# Altium schematic sheet eSolderControl_v3.SchDoc: =GlobalProjectName
size 410 x 297 mm; Author: Смирнов; SheetNumber: 1; SheetTotal: 1; PageSetup: Record=PageOptions|CenterHorizontal=True|CenterVertical=True|PrintScale=1.00|XCorrection=1.00|YCorrection=1.00|PrintKind=1|BorderSize=5000000|LeftOffset=0|BottomOffset=0|Orientation=2|PaperLength=1000|PaperWidth=1000|Scale=100|PaperSource=15|PrintQuality=1200|MediaType=1|DitherType=10|PaperKind=A3|PrintScaleMode=1; Weight: -; ScaleFactor: -
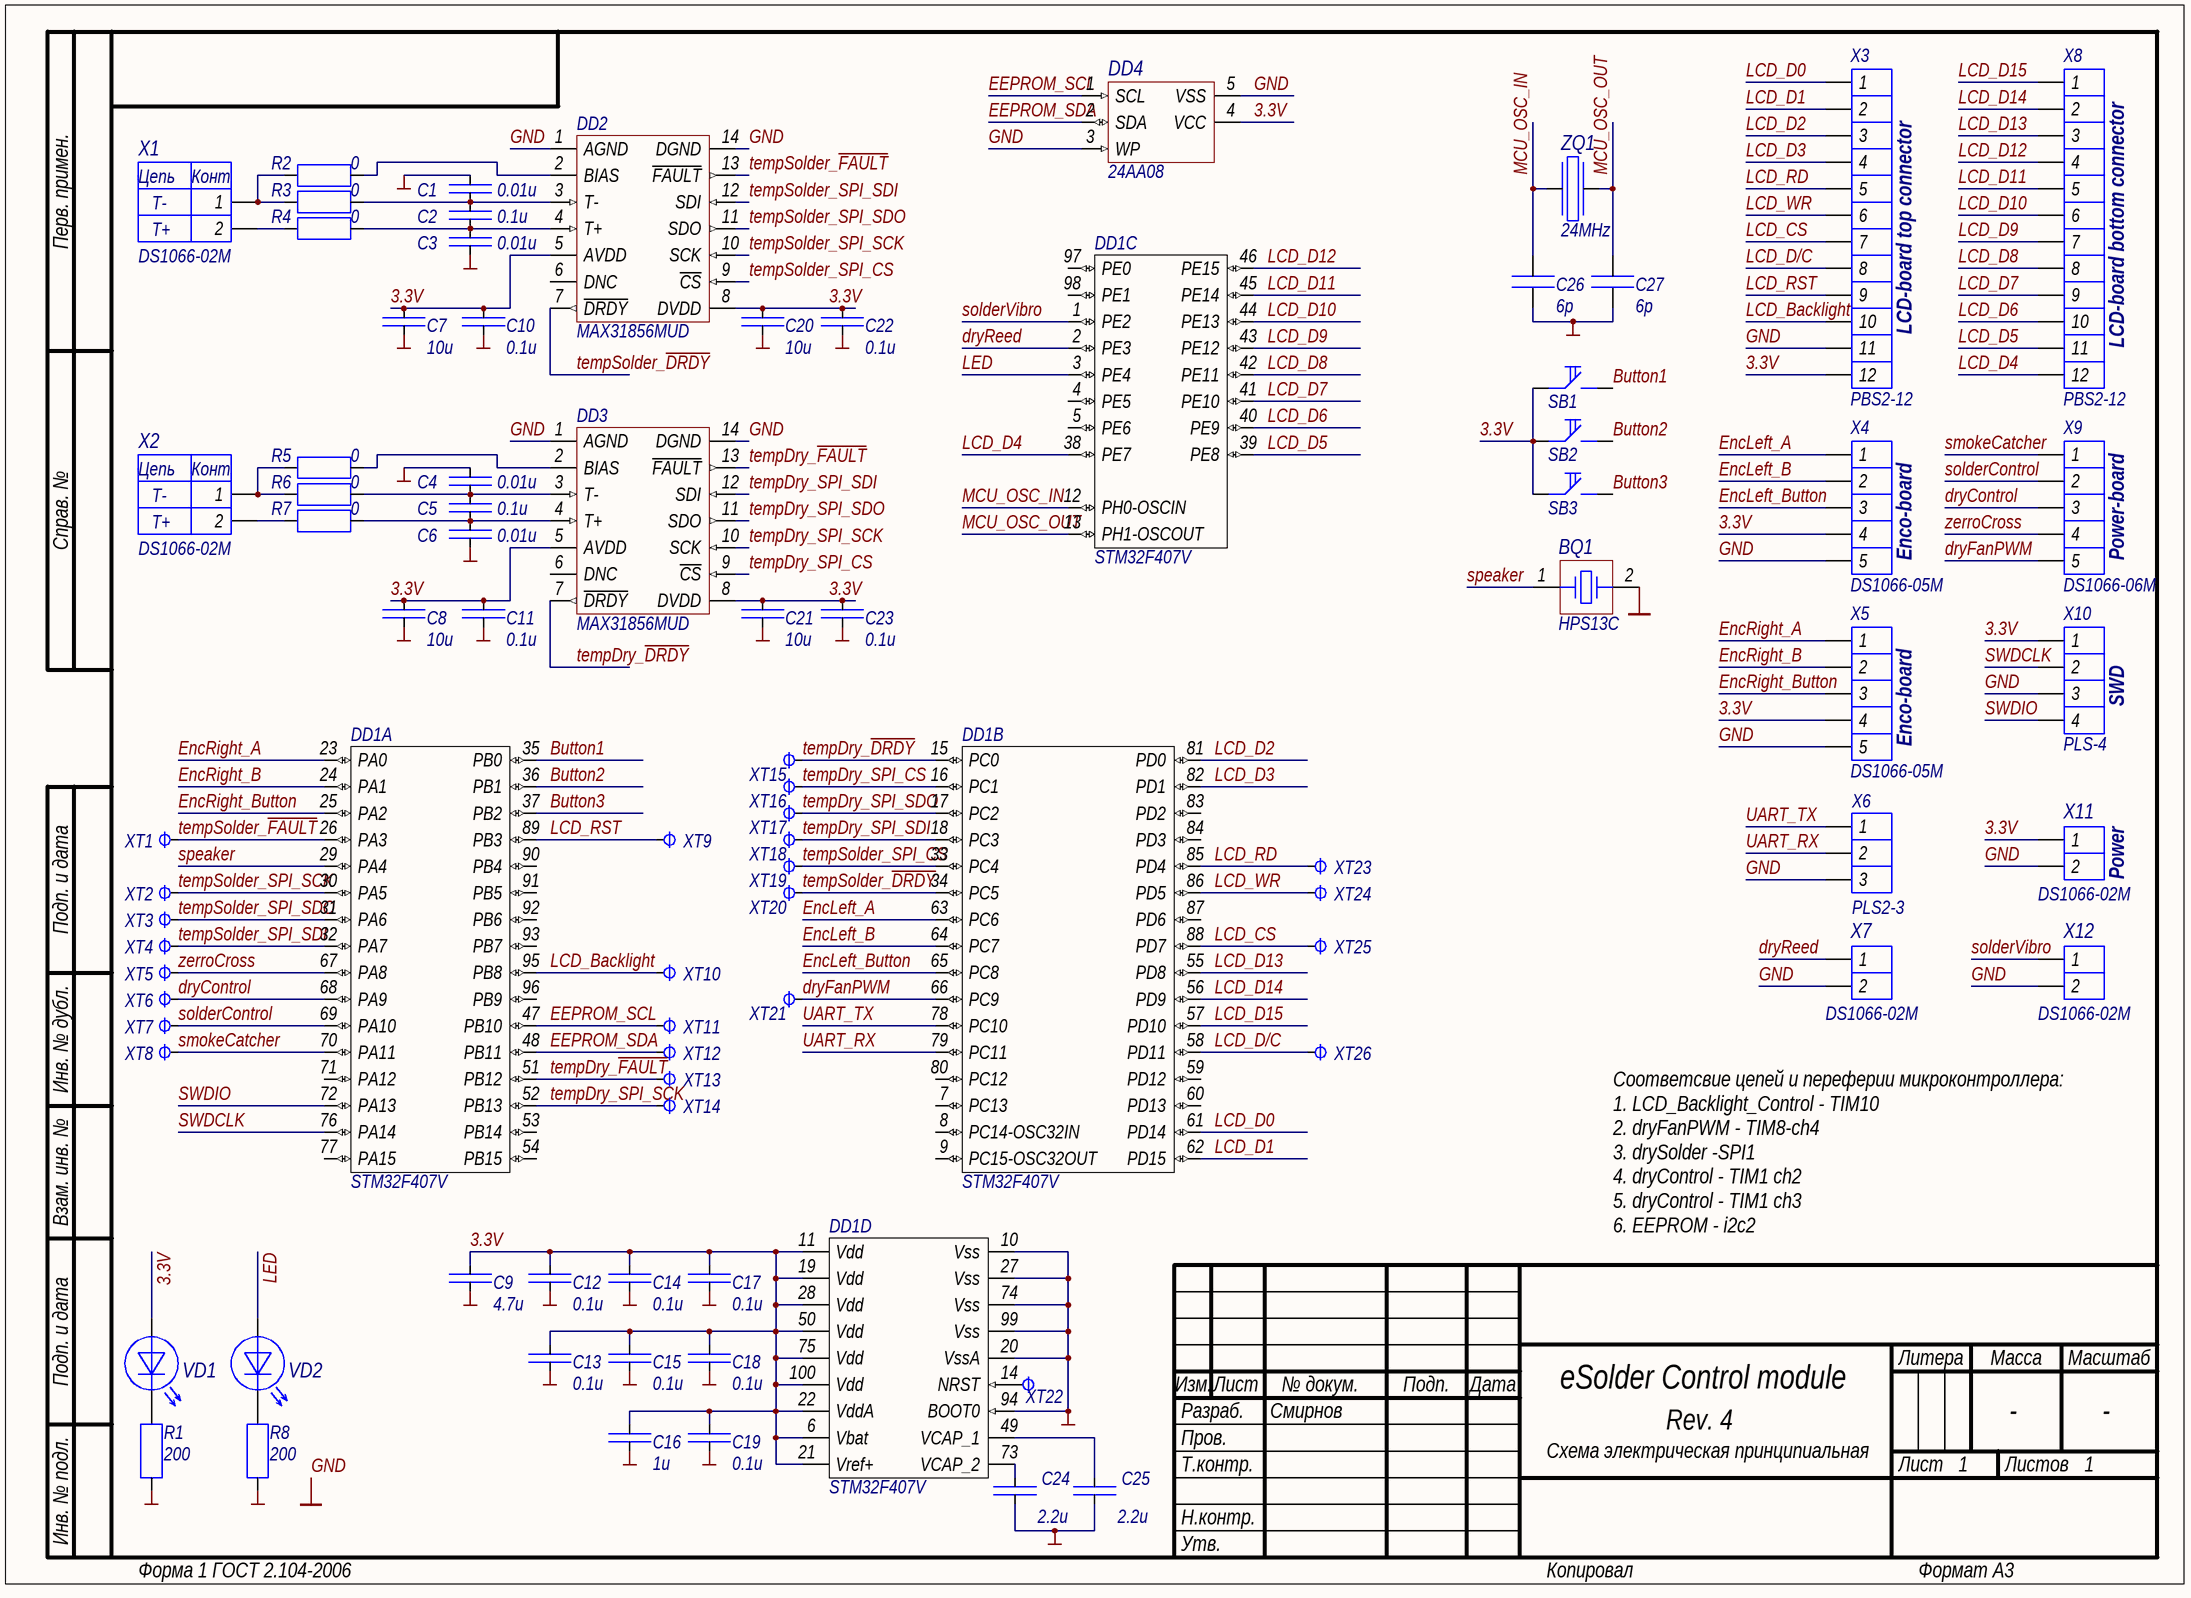
[diagram p0: eSolderControl_v3.SchDoc]

## Parts
BQ1  HPS13C  [HPS13C]
C1  0.01u  [C0603]
C2  0.1u  [C0603]
C3  0.01u  [C0603]
C4  0.01u  [C0603]
C5  0.1u  [C0603]
C6  0.01u  [C0603]
C7  10u  [C0603]
C8  10u  [C0603]
C9  4.7u  [C0603]
C10  0.1u  [C0603]
C11  0.1u  [C0603]
C12  0.1u  [C0603]
C13  0.1u  [C0603]
C14  0.1u  [C0603]
C15  0.1u  [C0603]
C16  1u  [C0603]
C17  0.1u  [C0603]
C18  0.1u  [C0603]
C19  0.1u  [C0603]
C20  10u  [C0603]
C21  10u  [C0603]
C22  0.1u  [C0603]
C23  0.1u  [C0603]
C24  2.2u  [C0603]
C25  2.2u  [C0603]
C26  6p  [C0603]
C27  6p  [C0603]
DD1  STM32F407V  [LQFP100]  (parts A,B,C,D of 4)
DD2  MAX31856MUD  [TSSOP65P640X120-14N]
DD3  MAX31856MUD  [TSSOP65P640X120-14N]
DD4  24AA08  [SOT95P245X145-5N]
R1  200  [R0603]
R2  0  [R0603]
R3  0  [R0603]
R4  0  [R0603]
R5  0  [R0603]
R6  0  [R0603]
R7  0  [R0603]
R8  200  [R0603]
SB1  *  [TS_6x6]  (value not drawn)
SB2  *  [TS_6x6]  (value not drawn)
SB3  *  [TS_6x6]  (value not drawn)
VD1  *  [LED 0603_Green]  (value not drawn)
VD2  *  [LED 0603_RED]  (value not drawn)
X1  DS1066-02M  [DS1066-02M]
X2  DS1066-02M  [DS1066-02M]
X3  PBS2-12  [PBS2-12]
X4  DS1066-05M  [DS1066-05M]
X5  DS1066-05M  [DS1066-05M]
X6  PLS2-3  [PLS2-3]
X7  DS1066-02M  [DS1066-02M]
X8  PBS2-12  [PBS2-12]
X9  DS1066-06M  [DS1066-05M]
X10  PLS-4  [PLS-4]
X11  DS1066-02M  [DS1066-02M]
X12  DS1066-02M  [DS1066-02M]
XT1  CheckPoint  [CheckPoint_2mm]  (value not drawn)  (no BOM)
XT2  CheckPoint  [CheckPoint_2mm]  (value not drawn)  (no BOM)
XT3  CheckPoint  [CheckPoint_2mm]  (value not drawn)  (no BOM)
XT4  CheckPoint  [CheckPoint_2mm]  (value not drawn)  (no BOM)
XT5  CheckPoint  [CheckPoint_2mm]  (value not drawn)  (no BOM)
XT6  CheckPoint  [CheckPoint_2mm]  (value not drawn)  (no BOM)
XT7  CheckPoint  [CheckPoint_2mm]  (value not drawn)  (no BOM)
XT8  CheckPoint  [CheckPoint_2mm]  (value not drawn)  (no BOM)
XT9  CheckPoint  [CheckPoint_2mm]  (value not drawn)  (no BOM)
XT10  CheckPoint  [CheckPoint_2mm]  (value not drawn)  (no BOM)
XT11  CheckPoint  [CheckPoint_2mm]  (value not drawn)  (no BOM)
XT12  CheckPoint  [CheckPoint_2mm]  (value not drawn)  (no BOM)
XT13  CheckPoint  [CheckPoint_2mm]  (value not drawn)  (no BOM)
XT14  CheckPoint  [CheckPoint_2mm]  (value not drawn)  (no BOM)
XT15  CheckPoint  [CheckPoint_2mm]  (value not drawn)  (no BOM)
XT16  CheckPoint  [CheckPoint_2mm]  (value not drawn)  (no BOM)
XT17  CheckPoint  [CheckPoint_2mm]  (value not drawn)  (no BOM)
XT18  CheckPoint  [CheckPoint_2mm]  (value not drawn)  (no BOM)
XT19  CheckPoint  [CheckPoint_2mm]  (value not drawn)  (no BOM)
XT20  CheckPoint  [CheckPoint_2mm]  (value not drawn)  (no BOM)
XT21  CheckPoint  [CheckPoint_2mm]  (value not drawn)  (no BOM)
XT22  CheckPoint  [CheckPoint_2mm]  (value not drawn)  (no BOM)
XT23  CheckPoint  [CheckPoint_2mm]  (value not drawn)  (no BOM)
XT24  CheckPoint  [CheckPoint_2mm]  (value not drawn)  (no BOM)
XT25  CheckPoint  [CheckPoint_2mm]  (value not drawn)  (no BOM)
XT26  CheckPoint  [CheckPoint_2mm]  (value not drawn)  (no BOM)
ZQ1  24MHz  [XRCGB_F_Z]

## Nets
GND: BQ1.2 C26.1 C27.1 DD2.1(AGND) DD2.14(DGND) DD3.1(AGND) DD3.14(DGND) DD4.3(WP) DD4.5(VSS) R1.2 R8.2 X3.11 X4.5 X5.5 X6.3 X7.2 X10.3 X11.2 X12.2
VCC: C1.2 C3.1 C4.2 C6.1 C7.1 C8.1 C9.1 C10.1 C11.1 C12.1 C13.1 C14.1 C15.1 C16.1 C17.1 C18.1 C19.1 C20.1 C21.1 C22.1 C23.1 C24.2 C25.1 DD1.10(Vss) DD1.20(VssA) DD1.27(Vss) DD1.74(Vss) DD1.94(BOOT0) DD1.99(Vss)
3.3V: C7.2 C8.2 C9.2 C10.2 C11.2 C12.2 C13.2 C14.2 C15.2 C16.2 C17.2 C18.2 C19.2 C20.2 C21.2 C22.2 C23.2 DD1.6(Vbat) DD1.11(Vdd) DD1.19(Vdd) DD1.21(Vref+) DD1.22(VddA) DD1.28(Vdd) DD1.50(Vdd) DD1.75(Vdd) DD1.100(Vdd) DD2.5(AVDD) DD2.8(DVDD) DD3.5(AVDD) DD3.8(DVDD) DD4.4(VCC) SB1.1 SB2.1 SB3.1 VD1.1 X3.12 X4.4 X5.4 X10.1 X11.1
Button1: DD1.35(PB0) SB1.2
Button2: DD1.36(PB1) SB2.2
Button3: DD1.37(PB2) SB3.2
dryControl: DD1.68(PA9) X9.3 XT6.1
dryFanPWM: DD1.66(PC9) X9.5 XT21.1
dryReed: DD1.2(PE3) X7.1
EEPROM_SCL: DD1.47(PB10) DD4.1(SCL) XT11.1
EEPROM_SDA: DD1.48(PB11) DD4.2(SDA) XT12.1
EncLeft_A: DD1.63(PC6) X4.1
EncLeft_B: DD1.64(PC7) X4.2
EncLeft_Button: DD1.65(PC8) X4.3
EncRight_A: DD1.23(PA0) X5.1
EncRight_B: DD1.24(PA1) X5.2
EncRight_Button: DD1.25(PA2) X5.3
LCD_Backlight: DD1.95(PB8) X3.10 XT10.1
LCD_CS: DD1.88(PD7) X3.7 XT25.1
LCD_D0: DD1.61(PD14) X3.1
LCD_D1: DD1.62(PD15) X3.2
LCD_D2: DD1.81(PD0) X3.3
LCD_D3: DD1.82(PD1) X3.4
LCD_D4: DD1.38(PE7) X8.12
LCD_D5: DD1.39(PE8) X8.11
LCD_D6: DD1.40(PE9) X8.10
LCD_D7: DD1.41(PE10) X8.9
LCD_D8: DD1.42(PE11) X8.8
LCD_D9: DD1.43(PE12) X8.7
LCD_D10: DD1.44(PE13) X8.6
LCD_D11: DD1.45(PE14) X8.5
LCD_D12: DD1.46(PE15) X8.4
LCD_D13: DD1.55(PD8) X8.3
LCD_D14: DD1.56(PD9) X8.2
LCD_D15: DD1.57(PD10) X8.1
LCD_D/C: DD1.58(PD11) X3.8 XT26.1
LCD_RD: DD1.85(PD4) X3.5 XT23.1
LCD_RST: DD1.89(PB3) X3.9 XT9.1
LCD_WR: DD1.86(PD5) X3.6 XT24.1
LED: DD1.3(PE4) VD2.1
MCU_OSC_IN: C26.2 DD1.12(PH0-OSCIN) ZQ1.1
MCU_OSC_OUT: C27.2 DD1.13(PH1-OSCOUT) ZQ1.2
smokeCatcher: DD1.70(PA11) X9.1 XT8.1
solderControl: DD1.69(PA10) X9.2 XT7.1
solderVibro: DD1.1(PE2) X12.1
speaker: BQ1.1 DD1.29(PA4)
SWDCLK: DD1.76(PA14) X10.2
SWDIO: DD1.72(PA13) X10.4
tempDry_~{DRDY}: DD1.15(PC0) DD3.7(~{DRDY}) XT15.1
tempDry_~{FAULT}: DD1.51(PB12) DD3.13(~{FAULT}) XT13.1
tempDry_SPI_CS: DD1.16(PC1) DD3.9(~{CS}) XT16.1
tempDry_SPI_SCK: DD1.52(PB13) DD3.10(SCK) XT14.1
tempDry_SPI_SDI: DD1.18(PC3) DD3.12(SDI) XT18.1
tempDry_SPI_SDO: DD1.17(PC2) DD3.11(SDO) XT17.1
tempSolder_~{DRDY}: DD1.34(PC5) DD2.7(~{DRDY}) XT20.1
tempSolder_~{FAULT}: DD1.26(PA3) DD2.13(~{FAULT}) XT1.1
tempSolder_SPI_CS: DD1.33(PC4) DD2.9(~{CS}) XT19.1
tempSolder_SPI_SCK: DD1.30(PA5) DD2.10(SCK) XT2.1
tempSolder_SPI_SDI: DD1.32(PA7) DD2.12(SDI) XT4.1
tempSolder_SPI_SDO: DD1.31(PA6) DD2.11(SDO) XT3.1
UART_RX: DD1.79(PC11) X6.2
UART_TX: DD1.78(PC10) X6.1
zerroCross: DD1.67(PA8) X9.4 XT5.1
NetC1_1: C1.1 C2.2 DD2.3(T-) R3.2
NetC2_1: C2.1 C3.2 DD2.4(T+) R4.2
NetC4_1: C4.1 C5.2 DD3.3(T-) R6.2
NetC5_1: C5.1 C6.2 DD3.4(T+) R7.2
NetC24_1: C24.1 DD1.73(VCAP_2)
NetC25_2: C25.2 DD1.49(VCAP_1)
NetDD1_14: DD1.14(NRST) XT22.1
NetDD2_2: DD2.2(BIAS) R2.2
NetDD3_2: DD3.2(BIAS) R5.2
NetR1_1: R1.1 VD1.2
NetR2_1: R2.1 R3.1 X1.1
NetR4_1: R4.1 X1.2
NetR5_1: R5.1 R6.1 X2.1
NetR7_1: R7.1 X2.2
NetR8_1: R8.1 VD2.2

Not connected (* = marked no-connect by the designer): DD1 4(PE5) 5(PE6) 7(PC13) 8(PC14-OSC32IN) 9(PC15-OSC32OUT) 53(PB14) 54(PB15) 59(PD12) 60(PD13) 71(PA12) 77(PA15) 80(PC12) 83(PD2) 84(PD3) 87(PD6) 90(PB4) 91(PB5) 92(PB6) 93(PB7) 96(PB9) 97(PE0) 98(PE1); DD2 6(DNC); DD3 6(DNC)

## Notes on the sheet
- Цепь
- (near X1) Конт
- T-
- T+
- (near X3) LCD-board top connector
- (near X8) LCD-board bottom connector
- (near X2) Конт
- (near X4) Enco-board
- (near X9) Power-board
- (near X10) SWD
- (near X5) Enco-board
- (near X11) Power
- Соответсвие цепей и переферии микроконтроллера:
  1. LCD_Backlight_Control - TIM10
  2. dryFanPWM - TIM8-ch4
  3. drySolder -SPI1
  4. dryControl - TIM1 ch2
  5. dryControl - TIM1 ch3
  6. EEPROM - i2c2
  7. UART - UART4
- eSolder Control module
- Rev. 4
- Перв. примен.
- Справ. №
- Подп. и дата
- Инв. № дубл.
- Взам. инв. №
- Разраб.
- Изм.
- Лист
- № докум.
- Подп.
- Дата
- Литера
- Масса
- Масштаб
- Пров.
- Т.контр.
- Схема электрическая принципиальная
- Листов
- Инв. № подл.
- Н.контр.
- Утв.
- Форма 1 ГОСТ 2.104-2006
- Копировал
- Формат А3

## Library data of the parts
BQ1 = Buzzer: Name: HPS13C; Value: *
C1-C25 = Capasitor: Name: *; Body: *
  C1 C3 C4 C6: Value: 0.01u
  C2 C5 C10-C15 C17-C19 C22 C23: Value: 0.1u
  C7 C8 C20 C21: Value: 10u
  C9: Value: 4.7u
  C16: Value: 1u
  C24 C25: Value: 2.2u
C26 C27 = Capasitor: Other: Алиэкспрес; Value: 6p
DD1 = STM32F407V: 100pins, 168MHz; Name: STM32F407V
DD4 = 24AA08: 8K I2C Serial EEPROM; Name: 24AA08; Value: *
R1-R8 = Resistor
  R1 R8: Value: 200; Other: *
  R2-R7: Value: 0; Name: *; Body: *
SB1-SB3 = Button: Value: *; Other: *
VD1 = LED: Value: 0603 green; Name: *
VD2 = LED: Value: 0603red; Name: *
X1 X2 X7 X11 X12 = 2-PIN: Other: *; Name: DS1066-02M
X3 X8 = 12-PIN: Name: PBS2-12; Value: *; Body: *
X4 X5 X9 = 5-PIN: Value: *
  X4 X5: Name: DS1066-05M
  X9: Name: DS1066-06M
X6 = 3-PIN: Name: PLS2-3; Pins: 3
X10 = 4-PIN: Name: PLS-4; Value: *
ZQ1 = Resonator: pin to pad: 2>3; Name: XRCGB_F_Z; Value: 24MHz
DD2 DD3 = MAX31856MUD: Name: MAX31856MUD